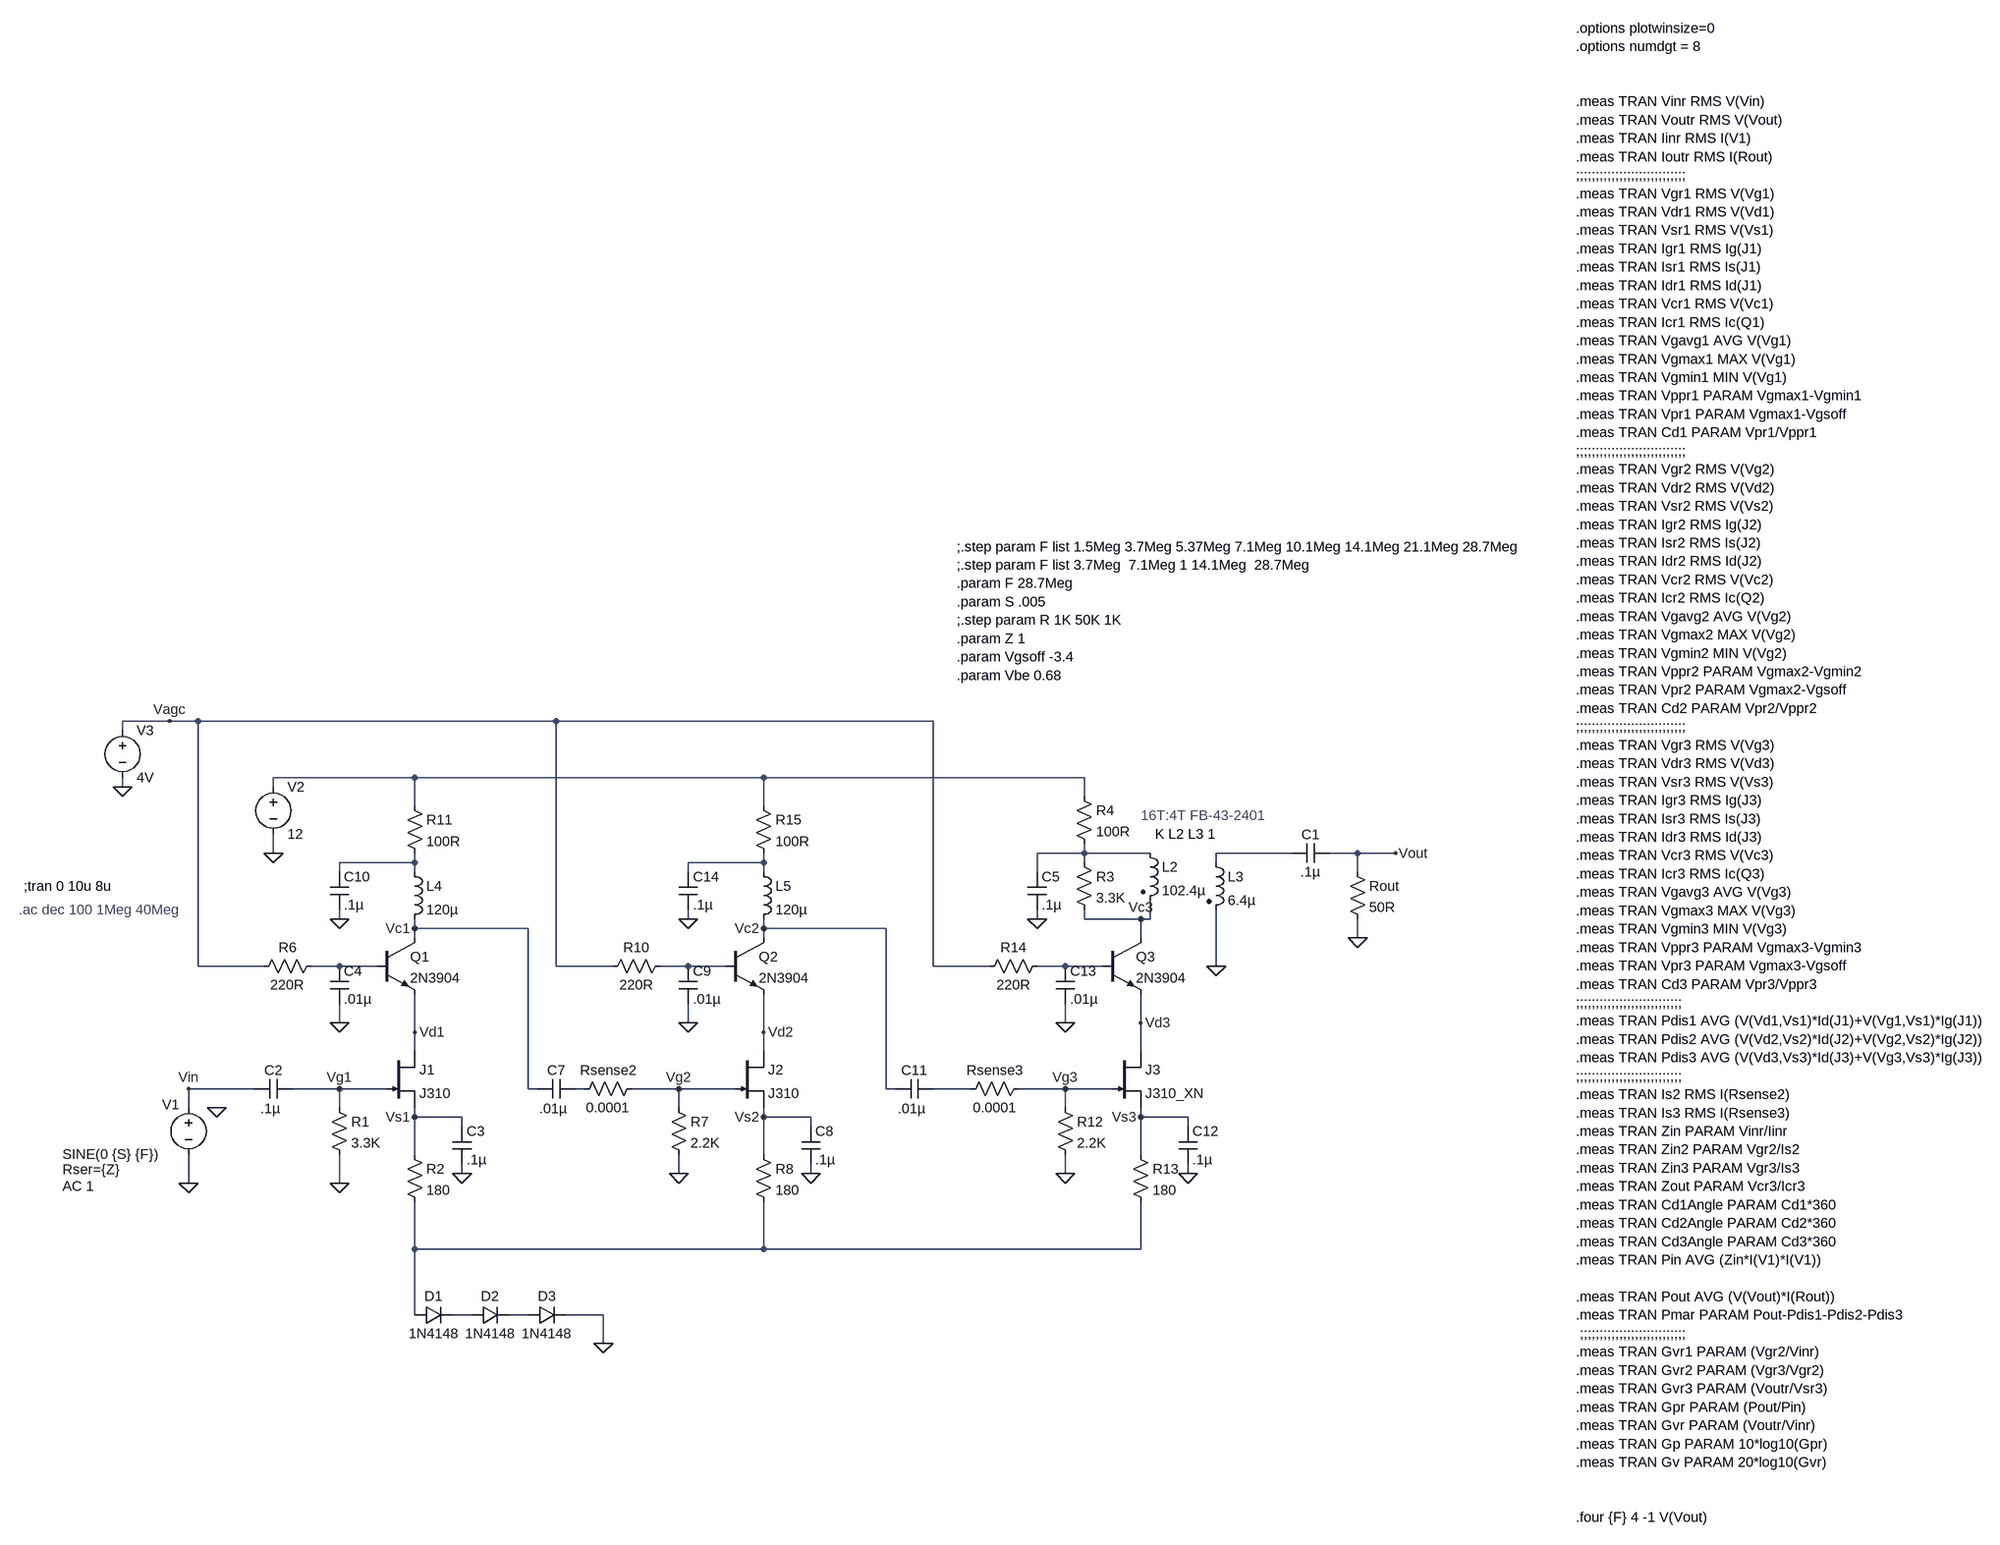
[diagram p0: schematic J310 3S Preamp Testing.asc]
J310 3S Preamp Testing.asc, the LTspice schematic file:
Version 4
SHEET 1 3300 1556
WIRE -128 -448 -208 -448
WIRE -80 -448 -128 -448
WIRE 528 -448 -80 -448
WIRE 1168 -448 528 -448
WIRE -208 -432 -208 -448
WIRE 288 -352 48 -352
WIRE 880 -352 288 -352
WIRE 1424 -352 880 -352
WIRE -208 -336 -208 -352
WIRE 48 -336 48 -352
WIRE 1424 -320 1424 -352
WIRE 288 -304 288 -352
WIRE 880 -304 880 -352
WIRE 48 -224 48 -256
WIRE 1424 -224 1424 -240
WIRE 1424 -224 1344 -224
WIRE 1536 -224 1424 -224
WIRE 1776 -224 1648 -224
WIRE 1888 -224 1840 -224
WIRE 1952 -224 1888 -224
WIRE 288 -208 288 -224
WIRE 288 -208 160 -208
WIRE 880 -208 880 -224
WIRE 880 -208 752 -208
WIRE 1424 -208 1424 -224
WIRE 1648 -208 1648 -224
WIRE 160 -192 160 -208
WIRE 288 -192 288 -208
WIRE 752 -192 752 -208
WIRE 880 -192 880 -208
WIRE 1344 -192 1344 -224
WIRE 1888 -192 1888 -224
WIRE 160 -112 160 -128
WIRE 752 -112 752 -128
WIRE 1344 -112 1344 -128
WIRE 1424 -112 1424 -128
WIRE 1520 -112 1424 -112
WIRE 1536 -112 1536 -144
WIRE 1536 -112 1520 -112
WIRE 288 -96 288 -112
WIRE 480 -96 288 -96
WIRE 880 -96 880 -112
WIRE 1088 -96 880 -96
WIRE 288 -80 288 -96
WIRE 880 -80 880 -96
WIRE 1520 -80 1520 -112
WIRE 1888 -80 1888 -112
WIRE -80 -32 -80 -448
WIRE 32 -32 -80 -32
WIRE 160 -32 112 -32
WIRE 224 -32 160 -32
WIRE 528 -32 528 -448
WIRE 624 -32 528 -32
WIRE 752 -32 704 -32
WIRE 816 -32 752 -32
WIRE 1168 -32 1168 -448
WIRE 1264 -32 1168 -32
WIRE 1392 -32 1344 -32
WIRE 1456 -32 1392 -32
WIRE 1648 -32 1648 -128
WIRE 160 64 160 32
WIRE 752 64 752 32
WIRE 1392 64 1392 32
WIRE 1520 64 1520 16
WIRE 288 80 288 16
WIRE 880 80 880 16
WIRE 288 112 288 80
WIRE 880 112 880 80
WIRE 1520 112 1520 64
WIRE 16 176 -96 176
WIRE 160 176 80 176
WIRE 240 176 160 176
WIRE 480 176 480 -96
WIRE 496 176 480 176
WIRE 576 176 560 176
WIRE 736 176 656 176
WIRE 832 176 736 176
WIRE 1088 176 1088 -96
WIRE 1104 176 1088 176
WIRE 1232 176 1168 176
WIRE 1392 176 1312 176
WIRE 1472 176 1392 176
WIRE -96 208 -96 176
WIRE 160 208 160 176
WIRE 736 208 736 176
WIRE 1392 208 1392 176
WIRE 288 224 288 208
WIRE 368 224 288 224
WIRE 880 224 880 208
WIRE 960 224 880 224
WIRE 1520 224 1520 208
WIRE 1600 224 1520 224
WIRE 368 240 368 224
WIRE 960 240 960 224
WIRE 1600 240 1600 224
WIRE 288 288 288 224
WIRE 880 288 880 224
WIRE 1520 288 1520 224
WIRE 368 320 368 304
WIRE 736 320 736 288
WIRE 960 320 960 304
WIRE 1392 320 1392 288
WIRE 1600 320 1600 304
WIRE -96 336 -96 288
WIRE 160 336 160 288
WIRE 288 448 288 368
WIRE 880 448 880 368
WIRE 880 448 288 448
WIRE 1520 448 1520 368
WIRE 1520 448 880 448
WIRE 288 560 288 448
WIRE 384 560 352 560
WIRE 480 560 448 560
WIRE 608 560 544 560
WIRE 608 608 608 560
FLAG 368 320 0
FLAG 48 -224 0
FLAG 160 64 0
FLAG 608 608 0
FLAG 1344 -112 0
FLAG -128 -448 Vagc
FLAG -208 -336 0
FLAG 960 320 0
FLAG 752 64 0
FLAG 736 320 0
FLAG 160 -112 0
FLAG 1600 320 0
FLAG 1392 64 0
FLAG 1392 320 0
FLAG 752 -112 0
FLAG 1888 -80 0
FLAG 1952 -224 Vout
FLAG -96 336 0
FLAG -96 176 Vin
FLAG -48 208 0
FLAG 160 336 0
FLAG 736 176 Vg2
FLAG 160 176 Vg1
FLAG 1392 176 Vg3
FLAG 288 224 Vs1
FLAG 880 224 Vs2
FLAG 1520 224 Vs3
FLAG 1648 -32 0
FLAG 288 80 Vd1
FLAG 880 80 Vd2
FLAG 1520 64 Vd3
FLAG 288 -96 Vc1
FLAG 880 -96 Vc2
FLAG 1520 -112 Vc3
SYMBOL res 144 192 R0
SYMATTR InstName R1
SYMATTR Value 3.3K
SYMBOL cap 80 160 R90
WINDOW 0 0 32 VBottom 2
WINDOW 3 34 37 VTop 2
SYMATTR InstName C2
SYMATTR Value .1µ
SYMBOL res 272 272 R0
SYMATTR InstName R2
SYMATTR Value 180
SYMBOL cap 352 240 R0
SYMATTR InstName C3
SYMATTR Value .1µ
SYMBOL diode 288 576 R270
WINDOW 0 32 32 VTop 2
WINDOW 3 0 32 VBottom 2
SYMATTR InstName D1
SYMATTR Value 1N4148
SYMBOL diode 384 576 R270
WINDOW 0 32 32 VTop 2
WINDOW 3 0 32 VBottom 2
SYMATTR InstName D2
SYMATTR Value 1N4148
SYMBOL diode 480 576 R270
WINDOW 0 32 32 VTop 2
WINDOW 3 0 32 VBottom 2
SYMATTR InstName D3
SYMATTR Value 1N4148
SYMBOL voltage 48 -352 R0
WINDOW 123 0 0 Left 2
WINDOW 39 0 0 Left 2
SYMATTR InstName V2
SYMATTR Value 12
SYMBOL ind2 1520 -240 R0
SYMATTR InstName L2
SYMATTR Value 102.4µ
SYMATTR Type ind
SYMBOL ind2 1632 -224 R0
SYMATTR InstName L3
SYMATTR Value 6.4µ
SYMATTR Type ind
SYMBOL res 1408 -224 R0
SYMATTR InstName R3
SYMATTR Value 3.3K
SYMBOL npn 224 -80 R0
SYMATTR InstName Q1
SYMATTR Value 2N3904
SYMBOL cap 144 -32 R0
SYMATTR InstName C4
SYMATTR Value .01µ
SYMBOL res 128 -48 R90
WINDOW 0 0 56 VBottom 2
WINDOW 3 32 56 VTop 2
SYMATTR InstName R6
SYMATTR Value 220R
SYMBOL cap 1328 -192 R0
SYMATTR InstName C5
SYMATTR Value .1µ
SYMBOL njf 240 112 R0
SYMATTR InstName J1
SYMATTR Value J310
SYMBOL voltage -208 -448 R0
WINDOW 123 0 0 Left 2
WINDOW 39 0 0 Left 2
SYMATTR InstName V3
SYMATTR Value 4V
SYMBOL res 720 192 R0
SYMATTR InstName R7
SYMATTR Value 2.2K
SYMBOL cap 560 160 R90
WINDOW 0 0 32 VBottom 2
WINDOW 3 34 37 VTop 2
SYMATTR InstName C7
SYMATTR Value .01µ
SYMBOL res 864 272 R0
SYMATTR InstName R8
SYMATTR Value 180
SYMBOL cap 944 240 R0
SYMATTR InstName C8
SYMATTR Value .1µ
SYMBOL npn 816 -80 R0
SYMATTR InstName Q2
SYMATTR Value 2N3904
SYMBOL cap 736 -32 R0
SYMATTR InstName C9
SYMATTR Value .01µ
SYMBOL res 720 -48 R90
WINDOW 0 0 56 VBottom 2
WINDOW 3 32 56 VTop 2
SYMATTR InstName R10
SYMATTR Value 220R
SYMBOL njf 832 112 R0
SYMATTR InstName J2
SYMATTR Value J310
SYMBOL ind 272 -208 R0
SYMATTR InstName L4
SYMATTR Value 120µ
SYMBOL res 272 -320 R0
SYMATTR InstName R11
SYMATTR Value 100R
SYMBOL res 1408 -336 R0
SYMATTR InstName R4
SYMATTR Value 100R
SYMBOL cap 144 -192 R0
SYMATTR InstName C10
SYMATTR Value .1µ
SYMBOL res 1376 192 R0
SYMATTR InstName R12
SYMATTR Value 2.2K
SYMBOL cap 1168 160 R90
WINDOW 0 0 32 VBottom 2
WINDOW 3 34 37 VTop 2
SYMATTR InstName C11
SYMATTR Value .01µ
SYMBOL res 1504 272 R0
SYMATTR InstName R13
SYMATTR Value 180
SYMBOL cap 1584 240 R0
SYMATTR InstName C12
SYMATTR Value .1µ
SYMBOL npn 1456 -80 R0
SYMATTR InstName Q3
SYMATTR Value 2N3904
SYMBOL cap 1376 -32 R0
SYMATTR InstName C13
SYMATTR Value .01µ
SYMBOL res 1360 -48 R90
WINDOW 0 0 56 VBottom 2
WINDOW 3 32 56 VTop 2
SYMATTR InstName R14
SYMATTR Value 220R
SYMBOL njf 1472 112 R0
SYMATTR InstName J3
SYMATTR Value J310_XN
SYMBOL ind 864 -208 R0
SYMATTR InstName L5
SYMATTR Value 120µ
SYMBOL res 864 -320 R0
SYMATTR InstName R15
SYMATTR Value 100R
SYMBOL cap 736 -192 R0
SYMATTR InstName C14
SYMATTR Value .1µ
SYMBOL res 1872 -208 R0
SYMATTR InstName Rout
SYMATTR Value 50R
SYMBOL voltage -96 192 R0
WINDOW 0 -45 11 Left 2
WINDOW 3 -214 95 Left 2
WINDOW 123 -214 149 Left 2
WINDOW 39 -214 121 Left 2
SYMATTR InstName V1
SYMATTR Value SINE(0 {S} {F})
SYMATTR Value2 AC 1
SYMATTR SpiceLine Rser={Z}
SYMBOL cap 1776 -208 R270
WINDOW 0 32 32 VTop 2
WINDOW 3 0 32 VBottom 2
SYMATTR InstName C1
SYMATTR Value .1µ
SYMBOL res 672 160 R90
WINDOW 0 0 56 VBottom 2
WINDOW 3 32 56 VTop 2
SYMATTR InstName Rsense2
SYMATTR Value 0.0001
SYMBOL res 1328 160 R90
WINDOW 0 0 56 VBottom 2
WINDOW 3 32 56 VTop 2
SYMATTR InstName Rsense3
SYMATTR Value 0.0001
TEXT -384 -128 Left 2 ;.ac dec 100 1Meg 40Meg
TEXT 1544 -256 Left 2 !K L2 L3 1
TEXT -376 -168 Left 2 !;tran 0 10u 8u
TEXT 1520 -288 Left 2 ;16T:4T FB-43-2401
TEXT 2552 -1624 Left 2 !.options plotwinsize=0\n.options numdgt = 8\n \n \n.meas TRAN Vinr RMS V(Vin)\n.meas TRAN Voutr RMS V(Vout)\n.meas TRAN Iinr RMS I(V1)\n.meas TRAN Ioutr RMS I(Rout)\n;;;;;;;;;;;;;;;;;;;;;;;;;;;;\n.meas TRAN Vgr1 RMS V(Vg1)\n.meas TRAN Vdr1 RMS V(Vd1)\n.meas TRAN Vsr1 RMS V(Vs1)\n.meas TRAN Igr1 RMS Ig(J1)\n.meas TRAN Isr1 RMS Is(J1)\n.meas TRAN Idr1 RMS Id(J1)\n.meas TRAN Vcr1 RMS V(Vc1)\n.meas TRAN Icr1 RMS Ic(Q1)\n.meas TRAN Vgavg1 AVG V(Vg1)\n.meas TRAN Vgmax1 MAX V(Vg1)\n.meas TRAN Vgmin1 MIN V(Vg1)\n.meas TRAN Vppr1 PARAM Vgmax1-Vgmin1\n.meas TRAN Vpr1 PARAM Vgmax1-Vgsoff\n.meas TRAN Cd1 PARAM Vpr1/Vppr1\n;;;;;;;;;;;;;;;;;;;;;;;;;;;;\n.meas TRAN Vgr2 RMS V(Vg2)\n.meas TRAN Vdr2 RMS V(Vd2)\n.meas TRAN Vsr2 RMS V(Vs2)\n.meas TRAN Igr2 RMS Ig(J2)\n.meas TRAN Isr2 RMS Is(J2)\n.meas TRAN Idr2 RMS Id(J2)\n.meas TRAN Vcr2 RMS V(Vc2)\n.meas TRAN Icr2 RMS Ic(Q2)\n.meas TRAN Vgavg2 AVG V(Vg2)\n.meas TRAN Vgmax2 MAX V(Vg2)\n.meas TRAN Vgmin2 MIN V(Vg2)\n.meas TRAN Vppr2 PARAM Vgmax2-Vgmin2\n.meas TRAN Vpr2 PARAM Vgmax2-Vgsoff\n.meas TRAN Cd2 PARAM Vpr2/Vppr2\n;;;;;;;;;;;;;;;;;;;;;;;;;;;;\n.meas TRAN Vgr3 RMS V(Vg3)\n.meas TRAN Vdr3 RMS V(Vd3)\n.meas TRAN Vsr3 RMS V(Vs3)\n.meas TRAN Igr3 RMS Ig(J3)\n.meas TRAN Isr3 RMS Is(J3)\n.meas TRAN Idr3 RMS Id(J3)\n.meas TRAN Vcr3 RMS V(Vc3)\n.meas TRAN Icr3 RMS Ic(Q3)\n.meas TRAN Vgavg3 AVG V(Vg3)\n.meas TRAN Vgmax3 MAX V(Vg3)\n.meas TRAN Vgmin3 MIN V(Vg3)\n.meas TRAN Vppr3 PARAM Vgmax3-Vgmin3\n.meas TRAN Vpr3 PARAM Vgmax3-Vgsoff\n.meas TRAN Cd3 PARAM Vpr3/Vppr3\n;;;;;;;;;;;;;;;;;;;;;;;;;;;\n.meas TRAN Pdis1 AVG (V(Vd1,Vs1)*Id(J1)+V(Vg1,Vs1)*Ig(J1))\n.meas TRAN Pdis2 AVG (V(Vd2,Vs2)*Id(J2)+V(Vg2,Vs2)*Ig(J2))\n.meas TRAN Pdis3 AVG (V(Vd3,Vs3)*Id(J3)+V(Vg3,Vs3)*Ig(J3))\n;;;;;;;;;;;;;;;;;;;;;;;;;;;\n.meas TRAN Is2 RMS I(Rsense2)\n.meas TRAN Is3 RMS I(Rsense3)\n.meas TRAN Zin PARAM Vinr/Iinr\n.meas TRAN Zin2 PARAM Vgr2/Is2\n.meas TRAN Zin3 PARAM Vgr3/Is3\n.meas TRAN Zout PARAM Vcr3/Icr3\n.meas TRAN Cd1Angle PARAM Cd1*360\n.meas TRAN Cd2Angle PARAM Cd2*360\n.meas TRAN Cd3Angle PARAM Cd3*360\n.meas TRAN Pin AVG (Zin*I(V1)*I(V1))\n \n.meas TRAN Pout AVG (V(Vout)*I(Rout))\n.meas TRAN Pmar PARAM Pout-Pdis1-Pdis2-Pdis3\n ;;;;;;;;;;;;;;;;;;;;;;;;;;;\n.meas TRAN Gvr1 PARAM (Vgr2/Vinr)\n.meas TRAN Gvr2 PARAM (Vgr3/Vgr2)\n.meas TRAN Gvr3 PARAM (Voutr/Vsr3)\n.meas TRAN Gpr PARAM (Pout/Pin)\n.meas TRAN Gvr PARAM (Voutr/Vinr)\n.meas TRAN Gp PARAM 10*log10(Gpr)\n.meas TRAN Gv PARAM 20*log10(Gvr)\n \n \n.four {F} 4 -1 V(Vout)
TEXT 1208 -744 Left 2 !;.step param F list 1.5Meg 3.7Meg 5.37Meg 7.1Meg 10.1Meg 14.1Meg 21.1Meg 28.7Meg\n;.step param F list 3.7Meg  7.1Meg 1 14.1Meg  28.7Meg\n.param F 28.7Meg\n.param S .005\n;.step param R 1K 50K 1K\n.param Z 1\n.param Vgsoff -3.4\n.param Vbe 0.68

The netlist it stands for:
* J310 3S Preamp Testing.asc
R1 Vg1 0 3.3K
C2 Vg1 Vin .1µ
R2 Vs1 N011 180
C3 Vs1 0 .1µ
D1 N011 N012 1N4148
D2 N012 N013 1N4148
D3 N013 0 1N4148
V2 N001 0 12
L2 N002 Vc3 102.4µ
L3 N003 0 6.4µ
R3 N002 Vc3 3.3K
Q1 Vc1 N006 Vd1 0 2N3904
C4 N006 0 .01µ
R6 N006 Vagc 220R
C5 N002 0 .1µ
J1 Vd1 Vg1 Vs1 J310
V3 Vagc 0 4V
R7 Vg2 0 2.2K
C7 N009 Vc1 .01µ
R8 Vs2 N011 180
C8 Vs2 0 .1µ
Q2 Vc2 N007 Vd2 0 2N3904
C9 N007 0 .01µ
R10 N007 Vagc 220R
J2 Vd2 Vg2 Vs2 J310
L4 N004 Vc1 120µ
R11 N001 N004 100R
R4 N001 N002 100R
C10 N004 0 .1µ
R12 Vg3 0 2.2K
C11 N010 Vc2 .01µ
R13 Vs3 N011 180
C12 Vs3 0 .1µ
Q3 Vc3 N008 Vd3 0 2N3904
C13 N008 0 .01µ
R14 N008 Vagc 220R
J3 Vd3 Vg3 Vs3 J310_XN
L5 N005 Vc2 120µ
R15 N001 N005 100R
C14 N005 0 .1µ
Rout Vout 0 50R
V1 Vin 0 SINE(0 {S} {F}) AC 1 Rser={Z}
C1 N003 Vout .1µ
Rsense2 Vg2 N009 0.0001
Rsense3 Vg3 N010 0.0001
.model D D
.lib standard.dio
.model NPN NPN
.model PNP PNP
.lib standard.bjt
.model NJF NJF
.model PJF PJF
.lib standard.jft
* .ac dec 100 1Meg 40Meg
K L2 L3 1
;tran 0 10u 8u
* 16T:4T FB-43-2401
.options plotwinsize=0
.options numdgt = 8
.meas TRAN Vinr RMS V(Vin)
.meas TRAN Voutr RMS V(Vout)
.meas TRAN Iinr RMS I(V1)
.meas TRAN Ioutr RMS I(Rout)
;;;;;;;;;;;;;;;;;;;;;;;;;;;;
.meas TRAN Vgr1 RMS V(Vg1)
.meas TRAN Vdr1 RMS V(Vd1)
.meas TRAN Vsr1 RMS V(Vs1)
.meas TRAN Igr1 RMS Ig(J1)
.meas TRAN Isr1 RMS Is(J1)
.meas TRAN Idr1 RMS Id(J1)
.meas TRAN Vcr1 RMS V(Vc1)
.meas TRAN Icr1 RMS Ic(Q1)
.meas TRAN Vgavg1 AVG V(Vg1)
.meas TRAN Vgmax1 MAX V(Vg1)
.meas TRAN Vgmin1 MIN V(Vg1)
.meas TRAN Vppr1 PARAM Vgmax1-Vgmin1
.meas TRAN Vpr1 PARAM Vgmax1-Vgsoff
.meas TRAN Cd1 PARAM Vpr1/Vppr1
;;;;;;;;;;;;;;;;;;;;;;;;;;;;
.meas TRAN Vgr2 RMS V(Vg2)
.meas TRAN Vdr2 RMS V(Vd2)
.meas TRAN Vsr2 RMS V(Vs2)
.meas TRAN Igr2 RMS Ig(J2)
.meas TRAN Isr2 RMS Is(J2)
.meas TRAN Idr2 RMS Id(J2)
.meas TRAN Vcr2 RMS V(Vc2)
.meas TRAN Icr2 RMS Ic(Q2)
.meas TRAN Vgavg2 AVG V(Vg2)
.meas TRAN Vgmax2 MAX V(Vg2)
.meas TRAN Vgmin2 MIN V(Vg2)
.meas TRAN Vppr2 PARAM Vgmax2-Vgmin2
.meas TRAN Vpr2 PARAM Vgmax2-Vgsoff
.meas TRAN Cd2 PARAM Vpr2/Vppr2
;;;;;;;;;;;;;;;;;;;;;;;;;;;;
.meas TRAN Vgr3 RMS V(Vg3)
.meas TRAN Vdr3 RMS V(Vd3)
.meas TRAN Vsr3 RMS V(Vs3)
.meas TRAN Igr3 RMS Ig(J3)
.meas TRAN Isr3 RMS Is(J3)
.meas TRAN Idr3 RMS Id(J3)
.meas TRAN Vcr3 RMS V(Vc3)
.meas TRAN Icr3 RMS Ic(Q3)
.meas TRAN Vgavg3 AVG V(Vg3)
.meas TRAN Vgmax3 MAX V(Vg3)
.meas TRAN Vgmin3 MIN V(Vg3)
.meas TRAN Vppr3 PARAM Vgmax3-Vgmin3
.meas TRAN Vpr3 PARAM Vgmax3-Vgsoff
.meas TRAN Cd3 PARAM Vpr3/Vppr3
;;;;;;;;;;;;;;;;;;;;;;;;;;;
.meas TRAN Pdis1 AVG (V(Vd1,Vs1)*Id(J1)+V(Vg1,Vs1)*Ig(J1))
.meas TRAN Pdis2 AVG (V(Vd2,Vs2)*Id(J2)+V(Vg2,Vs2)*Ig(J2))
.meas TRAN Pdis3 AVG (V(Vd3,Vs3)*Id(J3)+V(Vg3,Vs3)*Ig(J3))
;;;;;;;;;;;;;;;;;;;;;;;;;;;
.meas TRAN Is2 RMS I(Rsense2)
.meas TRAN Is3 RMS I(Rsense3)
.meas TRAN Zin PARAM Vinr/Iinr
.meas TRAN Zin2 PARAM Vgr2/Is2
.meas TRAN Zin3 PARAM Vgr3/Is3
.meas TRAN Zout PARAM Vcr3/Icr3
.meas TRAN Cd1Angle PARAM Cd1*360
.meas TRAN Cd2Angle PARAM Cd2*360
.meas TRAN Cd3Angle PARAM Cd3*360
.meas TRAN Pin AVG (Zin*I(V1)*I(V1))
.meas TRAN Pout AVG (V(Vout)*I(Rout))
.meas TRAN Pmar PARAM Pout-Pdis1-Pdis2-Pdis3
 ;;;;;;;;;;;;;;;;;;;;;;;;;;;
.meas TRAN Gvr1 PARAM (Vgr2/Vinr)
.meas TRAN Gvr2 PARAM (Vgr3/Vgr2)
.meas TRAN Gvr3 PARAM (Voutr/Vsr3)
.meas TRAN Gpr PARAM (Pout/Pin)
.meas TRAN Gvr PARAM (Voutr/Vinr)
.meas TRAN Gp PARAM 10*log10(Gpr)
.meas TRAN Gv PARAM 20*log10(Gvr)
.four {F} 4 -1 V(Vout)
;.step param F list 1.5Meg 3.7Meg 5.37Meg 7.1Meg 10.1Meg 14.1Meg 21.1Meg 28.7Meg
;.step param F list 3.7Meg  7.1Meg 1 14.1Meg  28.7Meg
.param F 28.7Meg
.param S .005
;.step param R 1K 50K 1K
.param Z 1
.param Vgsoff -3.4
.param Vbe 0.68
.backanno
.end